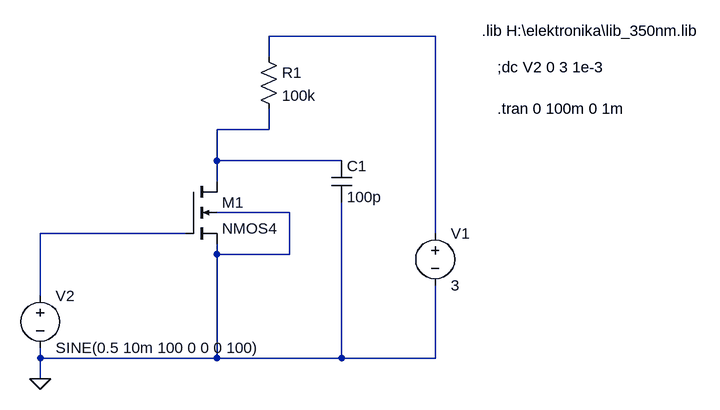
[diagram p0: schematic tranzistory.asc]
tranzistory.asc, the LTspice schematic file:
Version 4
SHEET 1 880 680
WIRE 384 0 128 0
WIRE 128 32 128 0
WIRE 128 144 128 112
WIRE 128 144 48 144
WIRE 48 192 48 144
WIRE 240 192 48 192
WIRE 48 224 48 192
WIRE 160 272 48 272
WIRE 0 304 -224 304
WIRE 384 304 384 0
WIRE 48 336 48 320
WIRE 160 336 160 272
WIRE 160 336 48 336
WIRE -224 400 -224 304
WIRE -224 496 -224 480
WIRE 48 496 48 336
WIRE 48 496 -224 496
WIRE 240 496 240 256
WIRE 240 496 48 496
WIRE 384 496 384 384
WIRE 384 496 240 496
WIRE -224 528 -224 496
FLAG -224 528 0
SYMBOL nmos4 0 224 R0
SYMATTR InstName M1
SYMATTR Value NMOS4
SYMATTR Value2 l=1u w=100u
SYMBOL res 112 16 R0
SYMATTR InstName R1
SYMATTR Value 100k
SYMBOL voltage 384 288 R0
WINDOW 123 0 0 Left 2
WINDOW 39 0 0 Left 2
SYMATTR InstName V1
SYMATTR Value 3
SYMBOL voltage -224 384 R0
WINDOW 123 24 124 Left 2
WINDOW 39 0 0 Left 2
SYMATTR InstName V2
SYMATTR Value SINE(0.5 10m 100 0 0 0 100)
SYMBOL cap 224 192 R0
SYMATTR InstName C1
SYMATTR Value 100p
TEXT 456 -8 Left 2 !.lib H:\\elektronika\\lib_350nm.lib
TEXT 480 48 Left 2 !;dc V2 0 3 1e-3
TEXT 480 112 Left 2 !.tran 0 100m 0 1m

The netlist it stands for:
* tranzistory.asc
M1 N002 N003 0 0 NMOS4 l=1u w=100u
R1 N001 N002 100k
V1 N001 0 3
V2 N003 0 SINE(0.5 10m 100 0 0 0 100)
C1 N002 0 100p
.model NMOS NMOS
.model PMOS PMOS
.lib standard.mos
.lib H:\elektronika\lib_350nm.lib
;dc V2 0 3 1e-3
.tran 0 100m 0 1m
.backanno
.end